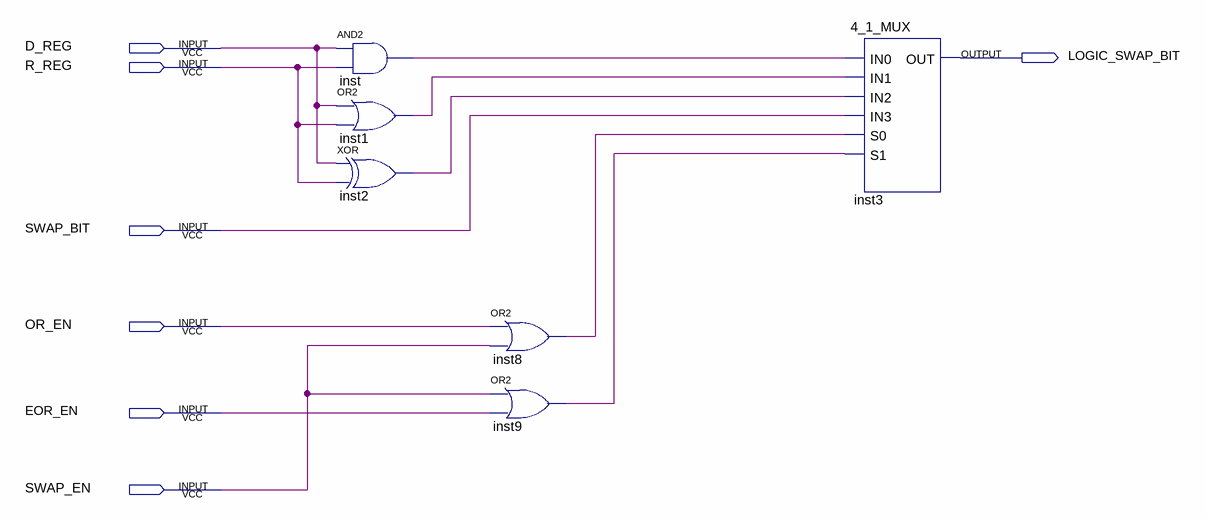
[diagram p0: schematic sheet]
// Quartus schematic LOGIC_SWAP.bdf as structural Verilog: 6 symbols, 7 pins
module LOGIC_SWAP (
  input  D_REG,
  input  R_REG,
  input  SWAP_BIT,
  input  OR_EN,
  input  EOR_EN,
  input  SWAP_EN,
  output LOGIC_SWAP_BIT
);

  wire inst1_out, inst2_out, inst8_out, inst9_out, inst_out;

  and inst (inst_out, D_REG, R_REG);
  or inst1 (inst1_out, D_REG, R_REG);
  xor inst2 (inst2_out, D_REG, R_REG);
  or inst8 (inst8_out, OR_EN, SWAP_EN);
  or inst9 (inst9_out, SWAP_EN, EOR_EN);
  \4_1_MUX  inst3 (
    .IN0(inst_out), .IN1(inst1_out), .IN2(inst2_out), .IN3(SWAP_BIT), .S0(inst8_out), .S1(inst9_out),
    .OUT(LOGIC_SWAP_BIT));
endmodule
